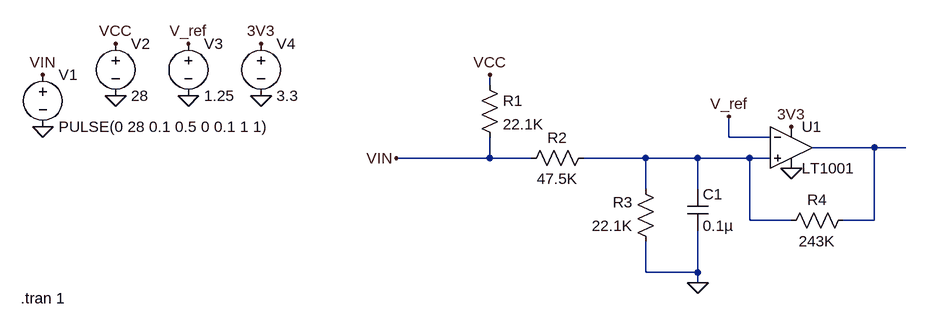
[diagram p0: schematic DiscreteInput.asc]
DiscreteInput.asc, the LTspice schematic file:
Version 4
SHEET 1 880 680
WIRE 192 80 192 64
WIRE 560 160 560 128
WIRE 624 160 560 160
WIRE 784 176 688 176
WIRE 832 176 784 176
WIRE 192 192 192 160
WIRE 192 192 48 192
WIRE 256 192 192 192
WIRE 432 192 336 192
WIRE 512 192 432 192
WIRE 592 192 512 192
WIRE 624 192 592 192
WIRE 432 240 432 192
WIRE 512 240 512 192
WIRE 592 288 592 192
WIRE 656 288 592 288
WIRE 784 288 784 176
WIRE 784 288 736 288
WIRE 432 368 432 320
WIRE 512 368 512 304
WIRE 512 368 432 368
WIRE 512 384 512 368
FLAG 192 64 VCC
FLAG 48 192 VIN
FLAG 512 384 0
FLAG 656 208 0
FLAG 656 144 3V3
FLAG 560 128 V_ref
FLAG -160 96 0
FLAG -272 96 0
FLAG -384 96 0
FLAG -496 144 0
FLAG -496 64 VIN
FLAG -384 16 VCC
FLAG -272 16 V_ref
FLAG -160 16 3V3
SYMBOL res 176 64 R0
SYMATTR InstName R1
SYMATTR Value 22.1K
SYMATTR SpiceLine tol=1 pwr=0.1
SYMBOL res 352 176 R90
WINDOW 0 0 56 VBottom 2
WINDOW 3 32 56 VTop 2
SYMATTR InstName R2
SYMATTR Value 47.5K
SYMATTR SpiceLine tol=1 pwr=0.1
SYMBOL res 448 336 R180
WINDOW 0 36 76 Left 2
WINDOW 3 36 40 Left 2
SYMATTR InstName R3
SYMATTR Value 22.1K
SYMATTR SpiceLine tol=1 pwr=0.1
SYMBOL cap 496 240 R0
SYMATTR InstName C1
SYMATTR Value 0.1µ
SYMATTR SpiceLine V=25 Irms=728m Rser=0.14361 Lser=0 mfg="KEMET" pn="C0603C104K3RAC" type="X7R"
SYMBOL voltage -496 48 R0
WINDOW 123 0 0 Left 0
WINDOW 39 0 0 Left 0
SYMATTR InstName V1
SYMATTR Value PULSE(0 28 0.1 0.5 0 0.1 1 1)
SYMBOL voltage -384 0 R0
WINDOW 123 0 0 Left 0
WINDOW 39 0 0 Left 0
SYMATTR InstName V2
SYMATTR Value 28
SYMBOL voltage -272 0 R0
WINDOW 123 0 0 Left 0
WINDOW 39 0 0 Left 0
SYMATTR InstName V3
SYMATTR Value 1.25
SYMBOL voltage -160 0 R0
WINDOW 123 0 0 Left 0
WINDOW 39 0 0 Left 0
SYMATTR InstName V4
SYMATTR Value 3.3
SYMBOL res 752 272 R90
WINDOW 0 0 56 VBottom 2
WINDOW 3 32 56 VTop 2
SYMATTR InstName R4
SYMATTR Value 243K
SYMATTR SpiceLine tol=1 pwr=0.1
SYMBOL Opamps\\LT1001 656 112 R0
SYMATTR InstName U1
TEXT -530 408 Left 2 !.tran 1

The netlist it stands for:
* DiscreteInput.asc
R1 VCC VIN 22.1K tol=1 pwr=0.1
R2 N002 VIN 47.5K tol=1 pwr=0.1
R3 0 N002 22.1K tol=1 pwr=0.1
C1 N002 0 0.1µ V=25 Irms=728m Rser=0.14361 Lser=0 mfg="KEMET" pn="C0603C104K3RAC" type="X7R"
V1 VIN 0 PULSE(0 28 0.1 0.5 0 0.1 1 1)
V2 VCC 0 28
V3 V_ref 0 1.25
V4 3V3 0 3.3
R4 N001 N002 243K tol=1 pwr=0.1
XU1 N002 V_ref 3V3 0 N001 LT1001  ; pins In+ In- V+ V- OUT
.tran 1
.lib LTC.lib
.backanno
.end